# EAGLE schematic Board 3 (EAGLE 9.1.1)
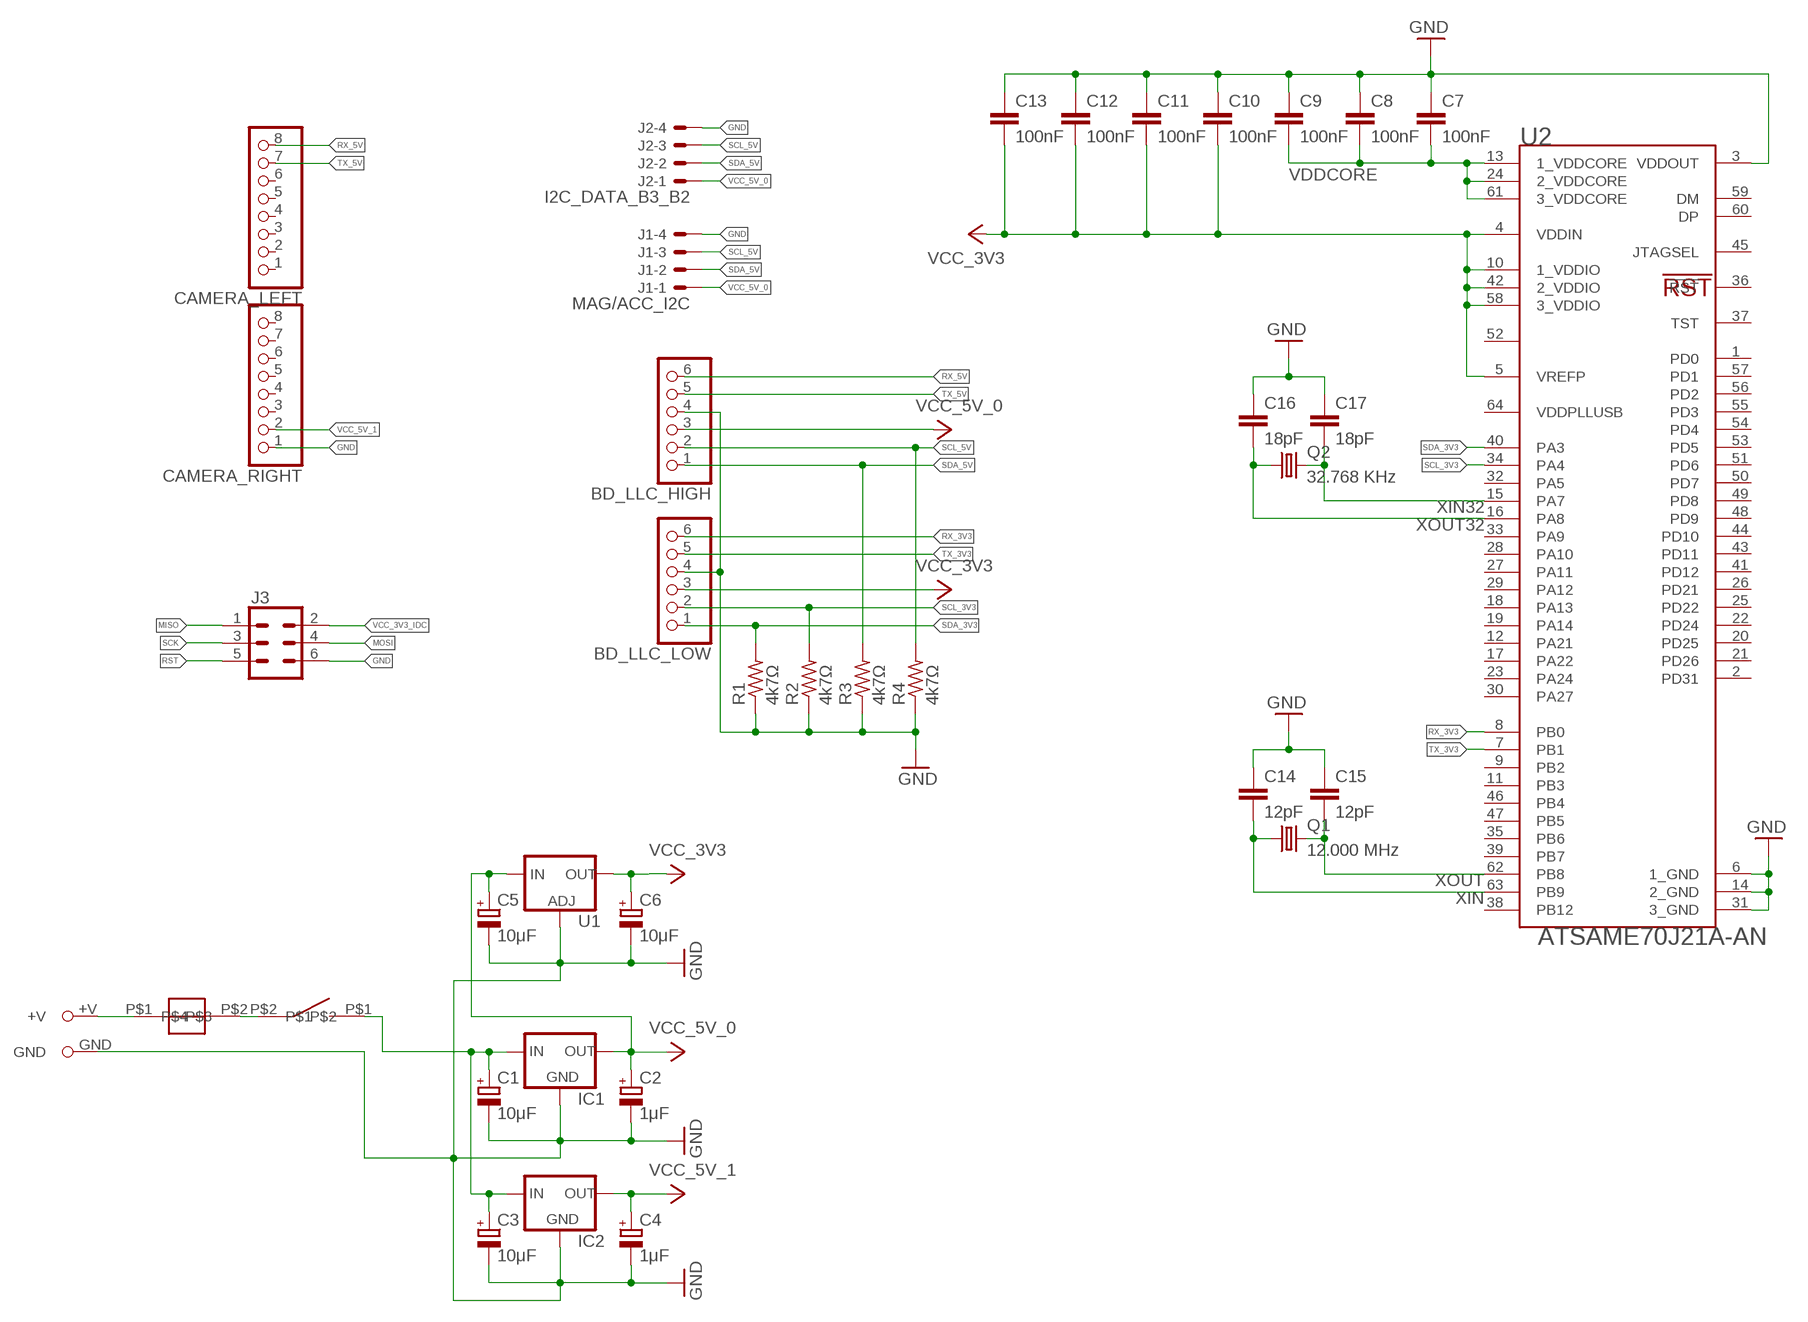
[diagram p0: schematic, sheet 1]

## Parts
BD_LLC_HIGH  PINHD-1X6  [1X06]
BD_LLC_LOW  PINHD-1X6  [1X06]
C1  10μF  CPOL-EUE2-5  [E2-5]
C2  1μF  CPOL-EUE2-5  [E2-5]
C3  10μF  CPOL-EUE2-5  [E2-5]
C4  1μF  CPOL-EUE2-5  [E2-5]
C5  10μF  CPOL-EUE2-5  [E2-5]
C6  10μF  CPOL-EUE2-5  [E2-5]
C7  100nF  C-EU050-024X044  [C050-024X044]
C8  100nF  C-EU050-024X044  [C050-024X044]
C9  100nF  C-EU050-024X044  [C050-024X044]
C10  100nF  C-EU050-024X044  [C050-024X044]
C11  100nF  C-EU050-024X044  [C050-024X044]
C12  100nF  C-EU050-024X044  [C050-024X044]
C13  100nF  C-EU050-024X044  [C050-024X044]
C14  12pF  C-EU050-024X044  [C050-024X044]
C15  12pF  C-EU050-024X044  [C050-024X044]
C16  18pF  C-EU050-024X044  [C050-024X044]
C17  18pF  C-EU050-024X044  [C050-024X044]
CAMERA_LEFT  PINHD-1X8  [1X08]
CAMERA_RIGHT  PINHD-1X8  [1X08]
IC1  78XXS  [78XXS]
IC2  78XXS  [78XXS]
J1  MAG/ACC_I2C  22-27-2041-04  [6410-04]
J2  I2C_DATA_B3_B2  22-27-2041-04  [6410-04]
J3  CONN_03X2SHROUD  [2X3-SHROUDED]
Q1  12.000 MHz  CRYSTALHC49U-V  [HC49U-V]
Q2  32.768 KHz  CRYSTALTC26V  [TC26V]
R1  4k7Ω  R-US_0207/10  [0207/10]
R2  4k7Ω  R-US_0207/10  [0207/10]
R3  4k7Ω  R-US_0207/10  [0207/10]
R4  4k7Ω  R-US_0207/10  [0207/10]
SICHERUNG1  SICHERUNG  [SICHERUNG]
U1  V_REG_LM1117SOT223  [SOT223]
U2  ATMEL_CORPORATION_ATSAME70J21A-ANATMEL_CORPORATION_ATSAME70J21A-AN_0_0  [ATMEL_CORPORATION_ATSAME70J21A-AN_0]
U$1  XT60  [XT60]
U$17  SCHALTER  [SCHALTER]

## Nets
+12V: C1.+ C3.+ IC1.IN IC2.IN U$17.P$1
GND: BD_LLC_HIGH.4 BD_LLC_LOW.4 C1.- C2.- C3.- C4.- C5.- C6.- C7.1 C8.1 C9.1 C10.1 C11.1 C12.1 C13.1 C14.1 C15.1 C16.1 C17.1 CAMERA_RIGHT.1 IC1.GND IC2.GND J1.4 J2.4 J3.6 R1.1 R2.1 R3.1 R4.1 U1.1(ADJ) U2.3(VDDOUT) U2.6(1_GND) U2.14(2_GND) U2.31(3_GND) U$1.GND
MISO: J3.1
MOSI: J3.4
N$1: SICHERUNG1.P$1 U$1.+V
N$2: SICHERUNG1.P$2 U$17.P$2
RST: J3.5
RX_3V3: BD_LLC_LOW.6 U2.8(PB0)
RX_5V: BD_LLC_HIGH.6 CAMERA_LEFT.8
SCK: J3.3
SCL_3V3: BD_LLC_LOW.2 R2.2 U2.34(PA4)
SCL_5V: BD_LLC_HIGH.2 J1.3 J2.3 R4.2
SDA_3V3: BD_LLC_LOW.1 R1.2 U2.40(PA3)
SDA_5V: BD_LLC_HIGH.1 J1.2 J2.2 R3.2
TX_3V3: BD_LLC_LOW.5 U2.7(PB1)
TX_5V: BD_LLC_HIGH.5 CAMERA_LEFT.7
VCC_3V3: BD_LLC_LOW.3 C6.+ C10.2 C11.2 C12.2 C13.2 U1.2(OUT) U1.4(OUT) U2.4(VDDIN) U2.5(VREFP) U2.10(1_VDDIO) U2.42(2_VDDIO) U2.58(3_VDDIO)
VCC_3V3_IDC: J3.2
VCC_5V_0: BD_LLC_HIGH.3 C2.+ C5.+ IC1.OUT J1.1 J2.1 U1.3(IN)
VCC_5V_1: C4.+ CAMERA_RIGHT.2 IC2.OUT
VDDCORE: C7.2 C8.2 C9.2 U2.13(1_VDDCORE) U2.24(2_VDDCORE) U2.61(3_VDDCORE)
XIN: C14.2 Q1.1 U2.63(PB9)
XIN32: C17.2 Q2.2 U2.15(PA7)
XOUT: C15.2 Q1.2 U2.62(PB8)
XOUT32: C16.2 Q2.1 U2.16(PA8)
Unconnected: CAMERA_LEFT.1 CAMERA_LEFT.2 CAMERA_LEFT.3 CAMERA_LEFT.4 CAMERA_LEFT.5 CAMERA_LEFT.6 CAMERA_RIGHT.3 CAMERA_RIGHT.4 CAMERA_RIGHT.5 CAMERA_RIGHT.6 CAMERA_RIGHT.7 CAMERA_RIGHT.8 U2.1(PD0) U2.2(PD31) U2.9(PB2) U2.11(PB3) U2.12(PA21) U2.17(PA22) U2.18(PA13) U2.19(PA14) U2.20(PD25) U2.21(PD26) U2.22(PD24) U2.23(PA24) U2.25(PD22) U2.26(PD21) U2.27(PA11) U2.28(PA10) U2.29(PA12) U2.30(PA27) U2.32(PA5) U2.33(PA9) U2.35(PB6) U2.36(!RST!) U2.37(TST) U2.38(PB12) U2.39(PB7) U2.41(PD12) U2.43(PD11) U2.44(PD10) U2.45(JTAGSEL) U2.46(PB4) U2.47(PB5) U2.48(PD9) U2.49(PD8) U2.50(PD7) U2.51(PD6) U2.52(VDDPLL) U2.53(PD5) U2.54(PD4) U2.55(PD3) U2.56(PD2) U2.57(PD1) U2.59(DM) U2.60(DP) U2.64(VDDPLLUSB)

## Library data of the parts
BD_LLC_HIGH BD_LLC_LOW = pinhead:PINHD-1X6: PIN HEADER
C1-C6 = rcl:CPOL-EU: POLARIZED CAPACITOR, European symbol; SPICEPREFIX: C
C7-C17 = rcl:C-EU: CAPACITOR, European symbol; SPICEPREFIX: C
CAMERA_LEFT CAMERA_RIGHT = pinhead:PINHD-1X8: PIN HEADER
IC1 IC2 = v-reg:78XXS: VOLTAGE REGULATOR
J1 J2 = con-molex:22-?-04: CONNECTOR wire to board 2.54 mm (.1 inch) pitch header; MF: MOLEX; OC_FARNELL: unknown; OC_NEWARK: unknown
J3 = SparkFun-Connectors:CONN_03X2: Multi connection point. Often used as Generic Header-pin footprint for 0.1 inch spaced/style header connections You can populate with any combo of single row headers, but if you'd like an exact match, check these: Header - 2x3 (Male, 0.1") <https://www.sparkfun.com/products/12807> (PRT-12807) Header - 2x3 (Female, 0.1") <https://www.sparkfun.com/products/13010> (PRT-13010) 2x3 Pin Shrouded Header <https://www.sparkfun.com/products/10877> (PRT-10877) On any of the 0.1 inch spaced packages, you can populate with these: Break Away Headers - Straight <https://www.sparkfun.com/products/116> (PRT-00116) Break Away Male Headers - Right Angle <https://www.sparkfun.com/products/553> (PRT-00553) Female Headers <https://www.sparkfun.com/products/115> (PRT-00115) Break Away Headers - Machine Pin <https://www.sparkfun.com/products/117> (PRT-00117) Break Away Female Headers - Swiss Machine Pin <https://www.sparkfun.com/products/743> (PRT-00743) Special note: the shrouded connector mates well with our 3x2 ribbon cables: Ribbon Crimp Connector - 6-pin (2x3, Female) <https://www.sparkfun.com/products/10651> (PRT-10651) Ribbon Cable - 6 wire (15ft) <https://www.sparkfun.com/products/10646> (PRT-10646); PROD_ID: CONN-10681; SF_ID: PRT_10877
Q1 = crystal:CRYSTAL: CRYSTAL; OC_FARNELL: 1666969; OC_NEWARK: unknown
Q2 = adafruit:CRYSTAL: CRYSTAL; OC_FARNELL: unknown; OC_NEWARK: unknown
R1-R4 = resistor:R-US_: RESISTOR, American symbol
SICHERUNG1 = sicherung1:SICHERUNG
U1 = SparkFun-IC-Power:V_REG_LM1117: Voltage Regulator LM1117 Standard adjustable voltage regulator but in SMD form. Spark Fun Electronics SKU : COM-00595; PROD_ID: VREG-08170
U2 = Atmel Corporation - ATSAME70J21A-AN:ATMEL_CORPORATION_ATSAME70J21A-AN: SMART ARM-based Flash MCU; CENTROID_NOT_SPECIFIED: No; DATASHEET: http://www.atmel.com/Images/Atmel-11296-32-bit-Cortex-M7-Microcontroller-SAM-E70Q-SAM-E70N-SAM-E70J_Datasheet.pdf; DIGIKEY_DESCRIPTION: IC MCU 32BIT 2MB FLASH 64LQFP; DIGIKEY_PART_NUMBER: ATSAME70J21A-AN-ND; LEAD_FREE: yes; MF: Atmel Corporation; MFG_PACKAGE_IDENT: http://www.atmel.com/Images/Atmel-8826-SEEPROM-PCB-Mounting-Guidelines-Surface-Mount-Packages-ApplicationNote.pdf; MOUSER_PART_NUMBER: 556-ATSAME70J21A-AN; MPN: ATSAME70J21A-AN; PACKAGE: LQFP64; PREFIX: U; ROHS: yes; TEMPERATURE_RANGE_HIGH: +105°C; TEMPERATURE_RANGE_LOW: -40°C
U$1 = Connectors:XT60
U$17 = Schalter:SCHALTER